# Altium schematic sheet ArbPwrBoost_P8.SchDoc: =ProjectTitle
size B; Engineer: Hab Collector; Organization: Altium Limited; Address1: 3621 Gin Way; Address2: Snellville, GA 30039; SheetNumber: 8; SheetTotal: 8
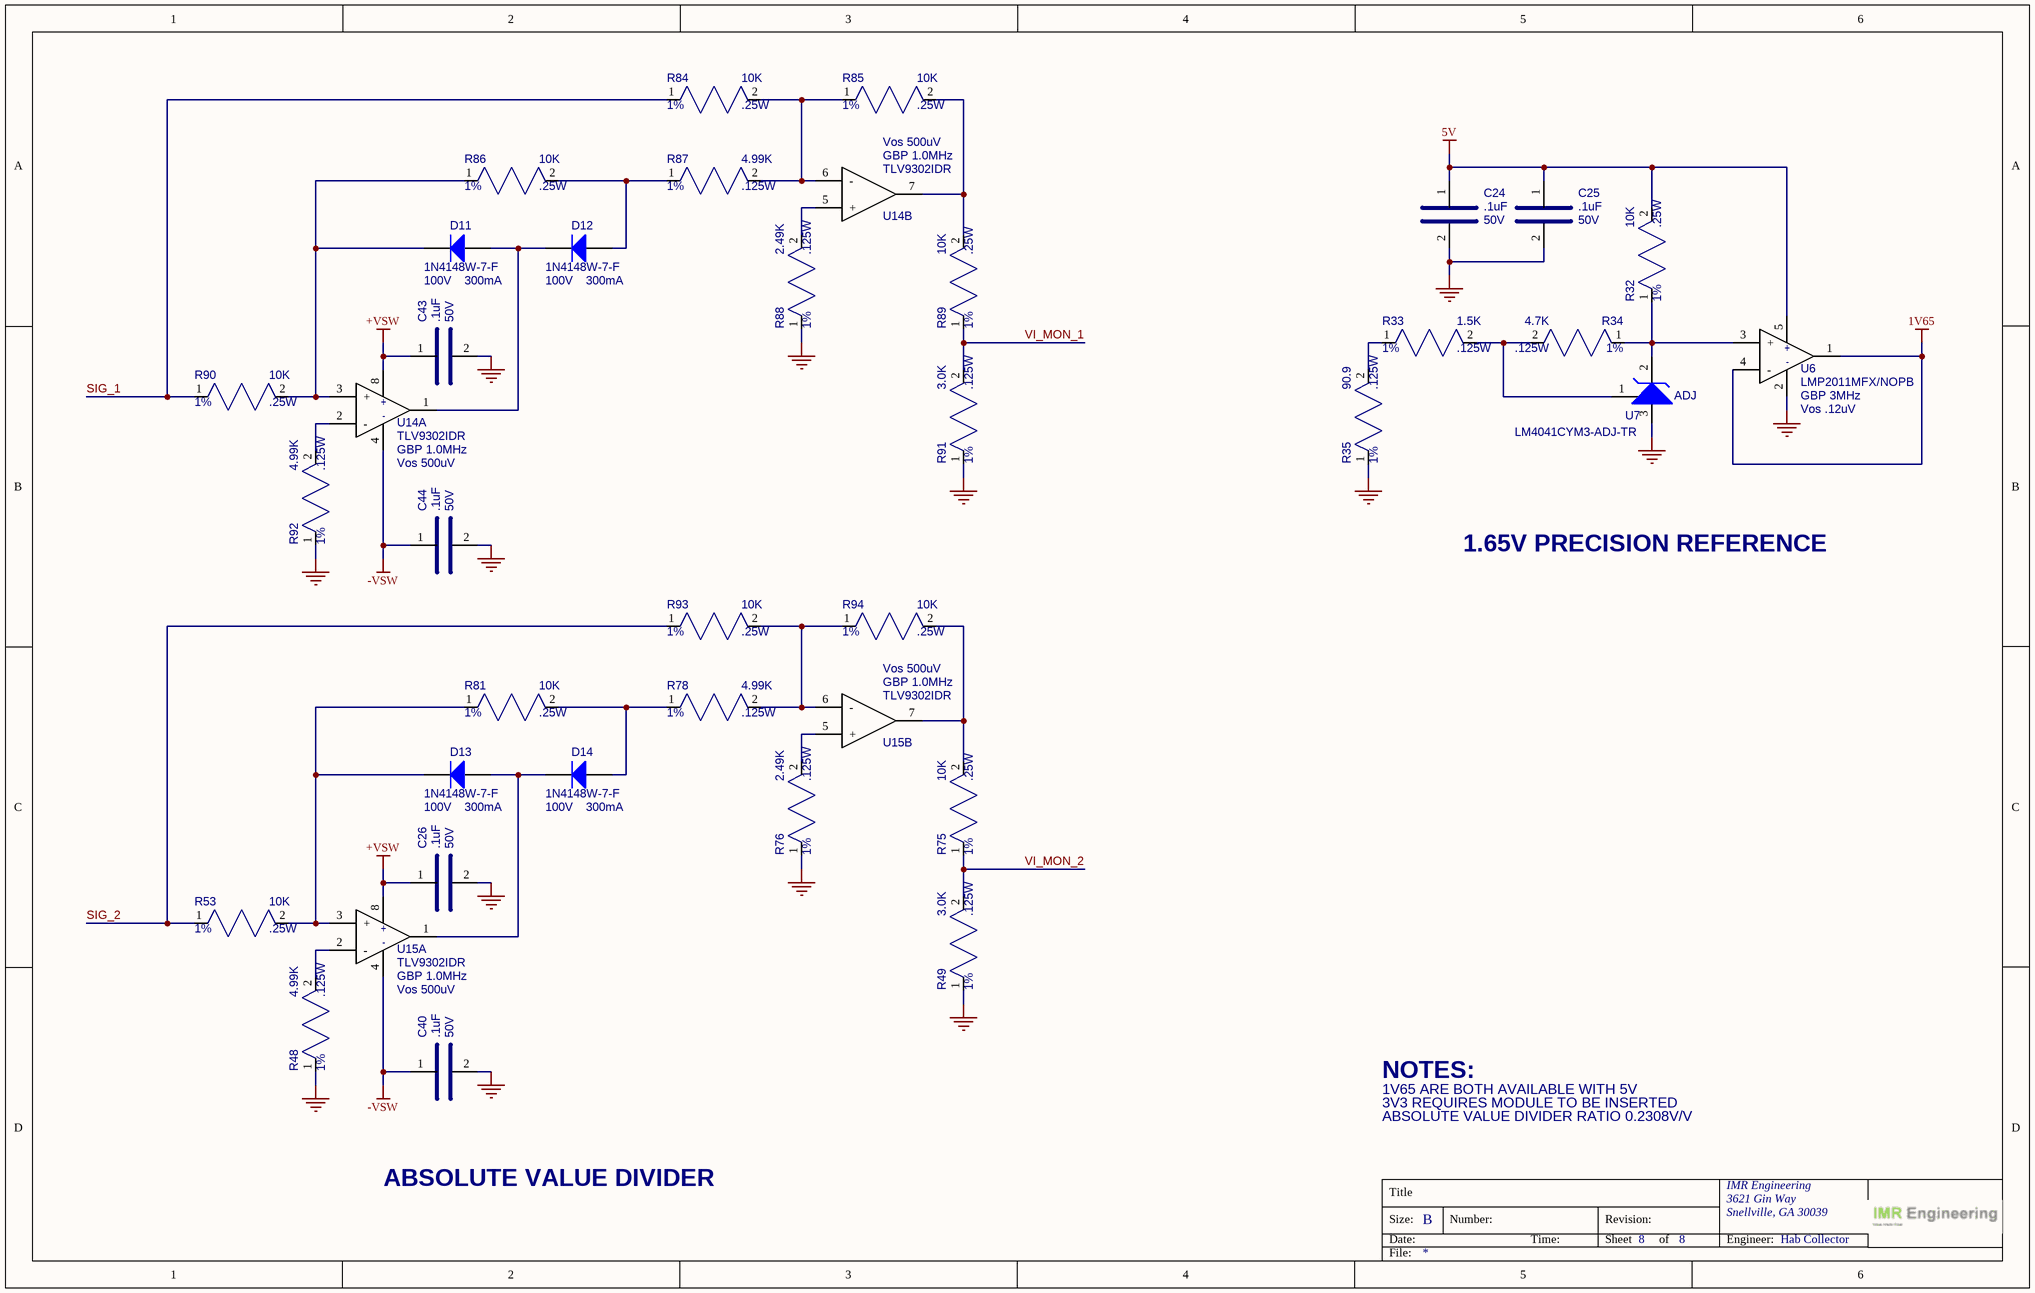
[diagram p0: ArbPwrBoost_P8.SchDoc]

## Parts
C24  value .1uF  Voltage: 50V  [CAP_0805]  (hidden comment: KGM21NR71H104KT)
C25  value .1uF  Voltage: 50V  [CAP_0805]  (hidden comment: KGM21NR71H104KT)
C26  value .1uF  Voltage: 50V  [CAP_0805]  (hidden comment: KGM21NR71H104KT)
C40  value .1uF  Voltage: 50V  [CAP_0805]  (hidden comment: KGM21NR71H104KT)
C43  value .1uF  Voltage: 50V  [CAP_0805]  (hidden comment: KGM21NR71H104KT)
C44  value .1uF  Voltage: 50V  [CAP_0805]  (hidden comment: KGM21NR71H104KT)
D11  value 100V  Current: 300mA  [SOD123]  (hidden comment: 1N4148W-7-F)
D12  value 100V  Current: 300mA  [SOD123]  (hidden comment: 1N4148W-7-F)
D13  value 100V  Current: 300mA  [SOD123]  (hidden comment: 1N4148W-7-F)
D14  value 100V  Current: 300mA  [SOD123]  (hidden comment: 1N4148W-7-F)
R32  value 10K  Power: .25W  Tolerance: 1%  [RES_0805]  (hidden comment: RC0805FR-7W10KL)
R33  value 1.5K  Power: .125W  Tolerance: 1%  [RES_0805]  (hidden comment: RC0805FR-071K5L)
R34  value 4.7K  Power: .125W  Tolerance: 1%  [RES_0805]  (hidden comment: RC0805FR-134K7L)
R35  value 90.9  Power: .125W  Tolerance: 1%  [RES_0805]  (hidden comment: RC0805FR-0790R9L)
R48  value 4.99K  Power: .125W  Tolerance: 1%  [RES_0805]  (hidden comment: RC0805FR-134K99L)
R49  value 3.0K  Power: .125W  Tolerance: 1%  [RES_0805]  (hidden comment: RC0805FR-133KL)
R53  value 10K  Power: .25W  Tolerance: 1%  [RES_0805]  (hidden comment: RC0805FR-7W10KL)
R75  value 10K  Power: .25W  Tolerance: 1%  [RES_0805]  (hidden comment: RC0805FR-7W10KL)
R76  value 2.49K  Power: .125W  Tolerance: 1%  [RES_0805]  (hidden comment: RC0805FR-132K49L)
R78  value 4.99K  Power: .125W  Tolerance: 1%  [RES_0805]  (hidden comment: RC0805FR-134K99L)
R81  value 10K  Power: .25W  Tolerance: 1%  [RES_0805]  (hidden comment: RC0805FR-7W10KL)
R84  value 10K  Power: .25W  Tolerance: 1%  [RES_0805]  (hidden comment: RC0805FR-7W10KL)
R85  value 10K  Power: .25W  Tolerance: 1%  [RES_0805]  (hidden comment: RC0805FR-7W10KL)
R86  value 10K  Power: .25W  Tolerance: 1%  [RES_0805]  (hidden comment: RC0805FR-7W10KL)
R87  value 4.99K  Power: .125W  Tolerance: 1%  [RES_0805]  (hidden comment: RC0805FR-134K99L)
R88  value 2.49K  Power: .125W  Tolerance: 1%  [RES_0805]  (hidden comment: RC0805FR-132K49L)
R89  value 10K  Power: .25W  Tolerance: 1%  [RES_0805]  (hidden comment: RC0805FR-7W10KL)
R90  value 10K  Power: .25W  Tolerance: 1%  [RES_0805]  (hidden comment: RC0805FR-7W10KL)
R91  value 3.0K  Power: .125W  Tolerance: 1%  [RES_0805]  (hidden comment: RC0805FR-133KL)
R92  value 4.99K  Power: .125W  Tolerance: 1%  [RES_0805]  (hidden comment: RC0805FR-134K99L)
R93  value 10K  Power: .25W  Tolerance: 1%  [RES_0805]  (hidden comment: RC0805FR-7W10KL)
R94  value 10K  Power: .25W  Tolerance: 1%  [RES_0805]  (hidden comment: RC0805FR-7W10KL)
U6  value GBP 3MHz  Vos: Vos .12uV  [SOT-23-5]  (hidden comment: LMP2011MFX/NOPB)
U7  value ADJ  [SOT-23]  (hidden comment: LM4041CYM3-ADJ-TR)
U14  value GBP 1.0MHz  Vos: Vos 500uV  [SOIC-8_49]  (hidden comment: TLV9302IDR)  (parts A,B of 2)
U15  value GBP 1.0MHz  Vos: Vos 500uV  [SOIC-8_49]  (hidden comment: TLV9302IDR)  (parts A,B of 2)

## Nets
1V65: U6.1 U6.4(-)
5V: C24.1 C25.1 R32.2 U6.5
+VSW: C26.1 C43.1 U14.8 U15.8
-VSW: C40.1 C44.1 U14.4 U15.4
GND: C24.2 C25.2 C26.2 C40.2 C43.2 C44.2 R35.1 R48.1 R49.1 R76.1 R88.1 R91.1 R92.1 U6.2 U7.3(A)
SIG_1: R84.1 R90.1
SIG_2: R53.1 R93.1
VI_MON_1: R89.1 R91.2
VI_MON_2: R49.2 R75.1
NetD11_1: D11.1(A) D12.2(K) U14.1
NetD11_2: D11.2(K) R86.1 R90.2 U14.3(+)
NetD12_1: D12.1(A) R86.2 R87.1
NetD13_1: D13.1(A) D14.2(K) U15.1
NetD13_2: D13.2(K) R53.2 R81.1 U15.3(+)
NetD14_1: D14.1(A) R78.1 R81.2
NetR32_1: R32.1 R34.1 U6.3(+) U7.2(K)
NetR33_1: R33.1 R35.2
NetR33_2: R33.2 R34.2 U7.1(FB)
NetR48_2: R48.2 U15.2(-)
NetR75_2: R75.2 R94.2 U15.7
NetR76_2: R76.2 U15.5(+)
NetR78_2: R78.2 R93.2 R94.1 U15.6(-)
NetR84_2: R84.2 R85.1 R87.2 U14.6(-)
NetR85_2: R85.2 R89.2 U14.7
NetR88_2: R88.2 U14.5(+)
NetR92_2: R92.2 U14.2(-)

## Notes on the sheet
- 1.65V PRECISION REFERENCE
- NOTES:
- 1V65 ARE BOTH AVAILABLE WITH 5V
- 3V3 REQUIRES MODULE TO BE INSERTED
- ABSOLUTE VALUE DIVIDER RATIO 0.2308V/V
- ABSOLUTE VALUE DIVIDER
- Title
- Size:
- Date:
- B
- Number:
- Time:
- Revision:
- Sheet
- of
- IMR Engineering
- Engineer:
- File:

## Library data of the parts
C24-C26 C40 C43 C44 = CAP_SMD_0.1UF_50V_0805: CAP CER 0.1UF 50V X7R 0805; MFG: KYOCERA AVX; Case/Package: 0805; MFG_PN: KGM21NR71H104KT; Supplier 1: DigiKey; Supplier Part Number 1: 478-KGM21NR71H104KTCT-ND; Unit Price: .1
D11-D14 = DIODE_1N4148W-7-F: RELAY REED SPDT 250MA 5V; MFG: Diodes Inc; Case/Package: SOD-123; Supplier 1: DigiKey; Supplier Part Number 1: 1N4148W-FDICT-ND; Unit Price: .16; MFG_PN: 1N4148W-7-F
R32 R53 R75 R81 R84-R86 R89 R90 R93 R94 = RES_SMD_10K_0805_1/4W_1%: RES SMD 10K OHM 1% 1/4W 0805; MFG: Yageo; Case/Package: 0805; MFG_PN: RC0805FR-7W10KL; Supplier 1: DigiKey; Supplier Part Number 1: 13-RC0805FR-7W10KLCT-ND; Unit Price: .10
R33 = RES_SMD_1.5K_0805_1/8W_1%: RES SMD 1.5K OHM 1% 1/8W 0805; MFG: Yageo; Case/Package: 0805; MFG_PN: RC0805FR-071K5L; Supplier 1: DigiKey; Supplier Part Number 1: 311-1.50KCRCT-ND; Unit Price: .1
R34 = RES_SMD_4.7K_0805_1/8W_1%: RES SMD 4.7K OHM 1% 1/8W 0805; MFG: Yageo; Case/Package: 0805; MFG_PN: RC0805FR-134K7L; Supplier 1: DigiKey; Supplier Part Number 1: 13-RC0805FR-134K7LCT-ND; Unit Price: .1
R35 = RES_SMD_90.9_0805_1/8W_1%: RES SMD 90.9 OHM 1% 1/8W 0805; MFG: Yageo; Case/Package: 0805; MFG_PN: RC0805FR-0790R9L; Supplier 1: DigiKey; Supplier Part Number 1: 311-90.9CRCT-ND; Unit Price: .1
R48 R78 R87 R92 = RES_SMD_4.99K_0805_1/8W_1%: RES SMD 4.99K OHM 1% 1/8W 0805; MFG: Yageo; Case/Package: 0805; MFG_PN: RC0805FR-134K99L; Supplier 1: DigiKey; Supplier Part Number 1: 13-RC0805FR-134K99LCT-ND; Unit Price: .1
R49 R91 = RES_SMD_3.0K_0805_1/8W_1%: RES SMD 3.0K OHM 1% 1/8W 0805; MFG: Yageo; Case/Package: 0805; MFG_PN: RC0805FR-133KL; Supplier 1: DigiKey; Supplier Part Number 1: 13-RC0805FR-133KLCT-ND; Unit Price: .1
R76 R88 = RES_SMD_2.49K_0805_1/8W_1%: RES SMD 2.49K OHM 1% 1/8W 0805; MFG: Yageo; Case/Package: 0805; MFG_PN: RC0805FR-132K49L; Supplier 1: DigiKey; Supplier Part Number 1: 13-RC0805FR-132K49LCT-ND; Unit Price: .1
U6 = OPAMP_LMP2011MFX/NOPB: IC OPAMP GP 3MHZ .12uV CIRCUIT SOT23-5; MFG: Texas Instruments; Package/Case: SOT-23-5; Supplier 1: DigiKey; MFG_PN: LMP2011MFX/NOPB; Unit Price: 2.33; Supplier Part Number 1: LMP2011MFX/NOPBCT-ND
U7 = IC_LM4041CYM3-ADJ-TR: IC VREF SHUNT ADJ 0.5% SOT23-3; MFG: Microchip; Case/Package: SOT-23; Supplier 1: DigiKey; Supplier Part Number 1: 576-1049-1-ND; Unit Price: .39; MFG_PN: LM4041CYM3-ADJ-TR
U14 U15 = OPAMP_TLV9302IDR: IC OPAMP GP 2 CIRCUIT 8SOIC; MFG: Texas Instruments; Unit Price: .66; Package/Case: SOT-353; Supplier 1: DigiKey; Supplier Part Number 1: 296-53513-1-ND; MFG_PN: TLV9302IDR